# EasyEDA schematic SCH.json
TITLE: Sheet_1; REV: 1.0; Date: 2023-08-11; Sheet: 1/1; Drawn By: bqdrsrxq; Company: Your Company
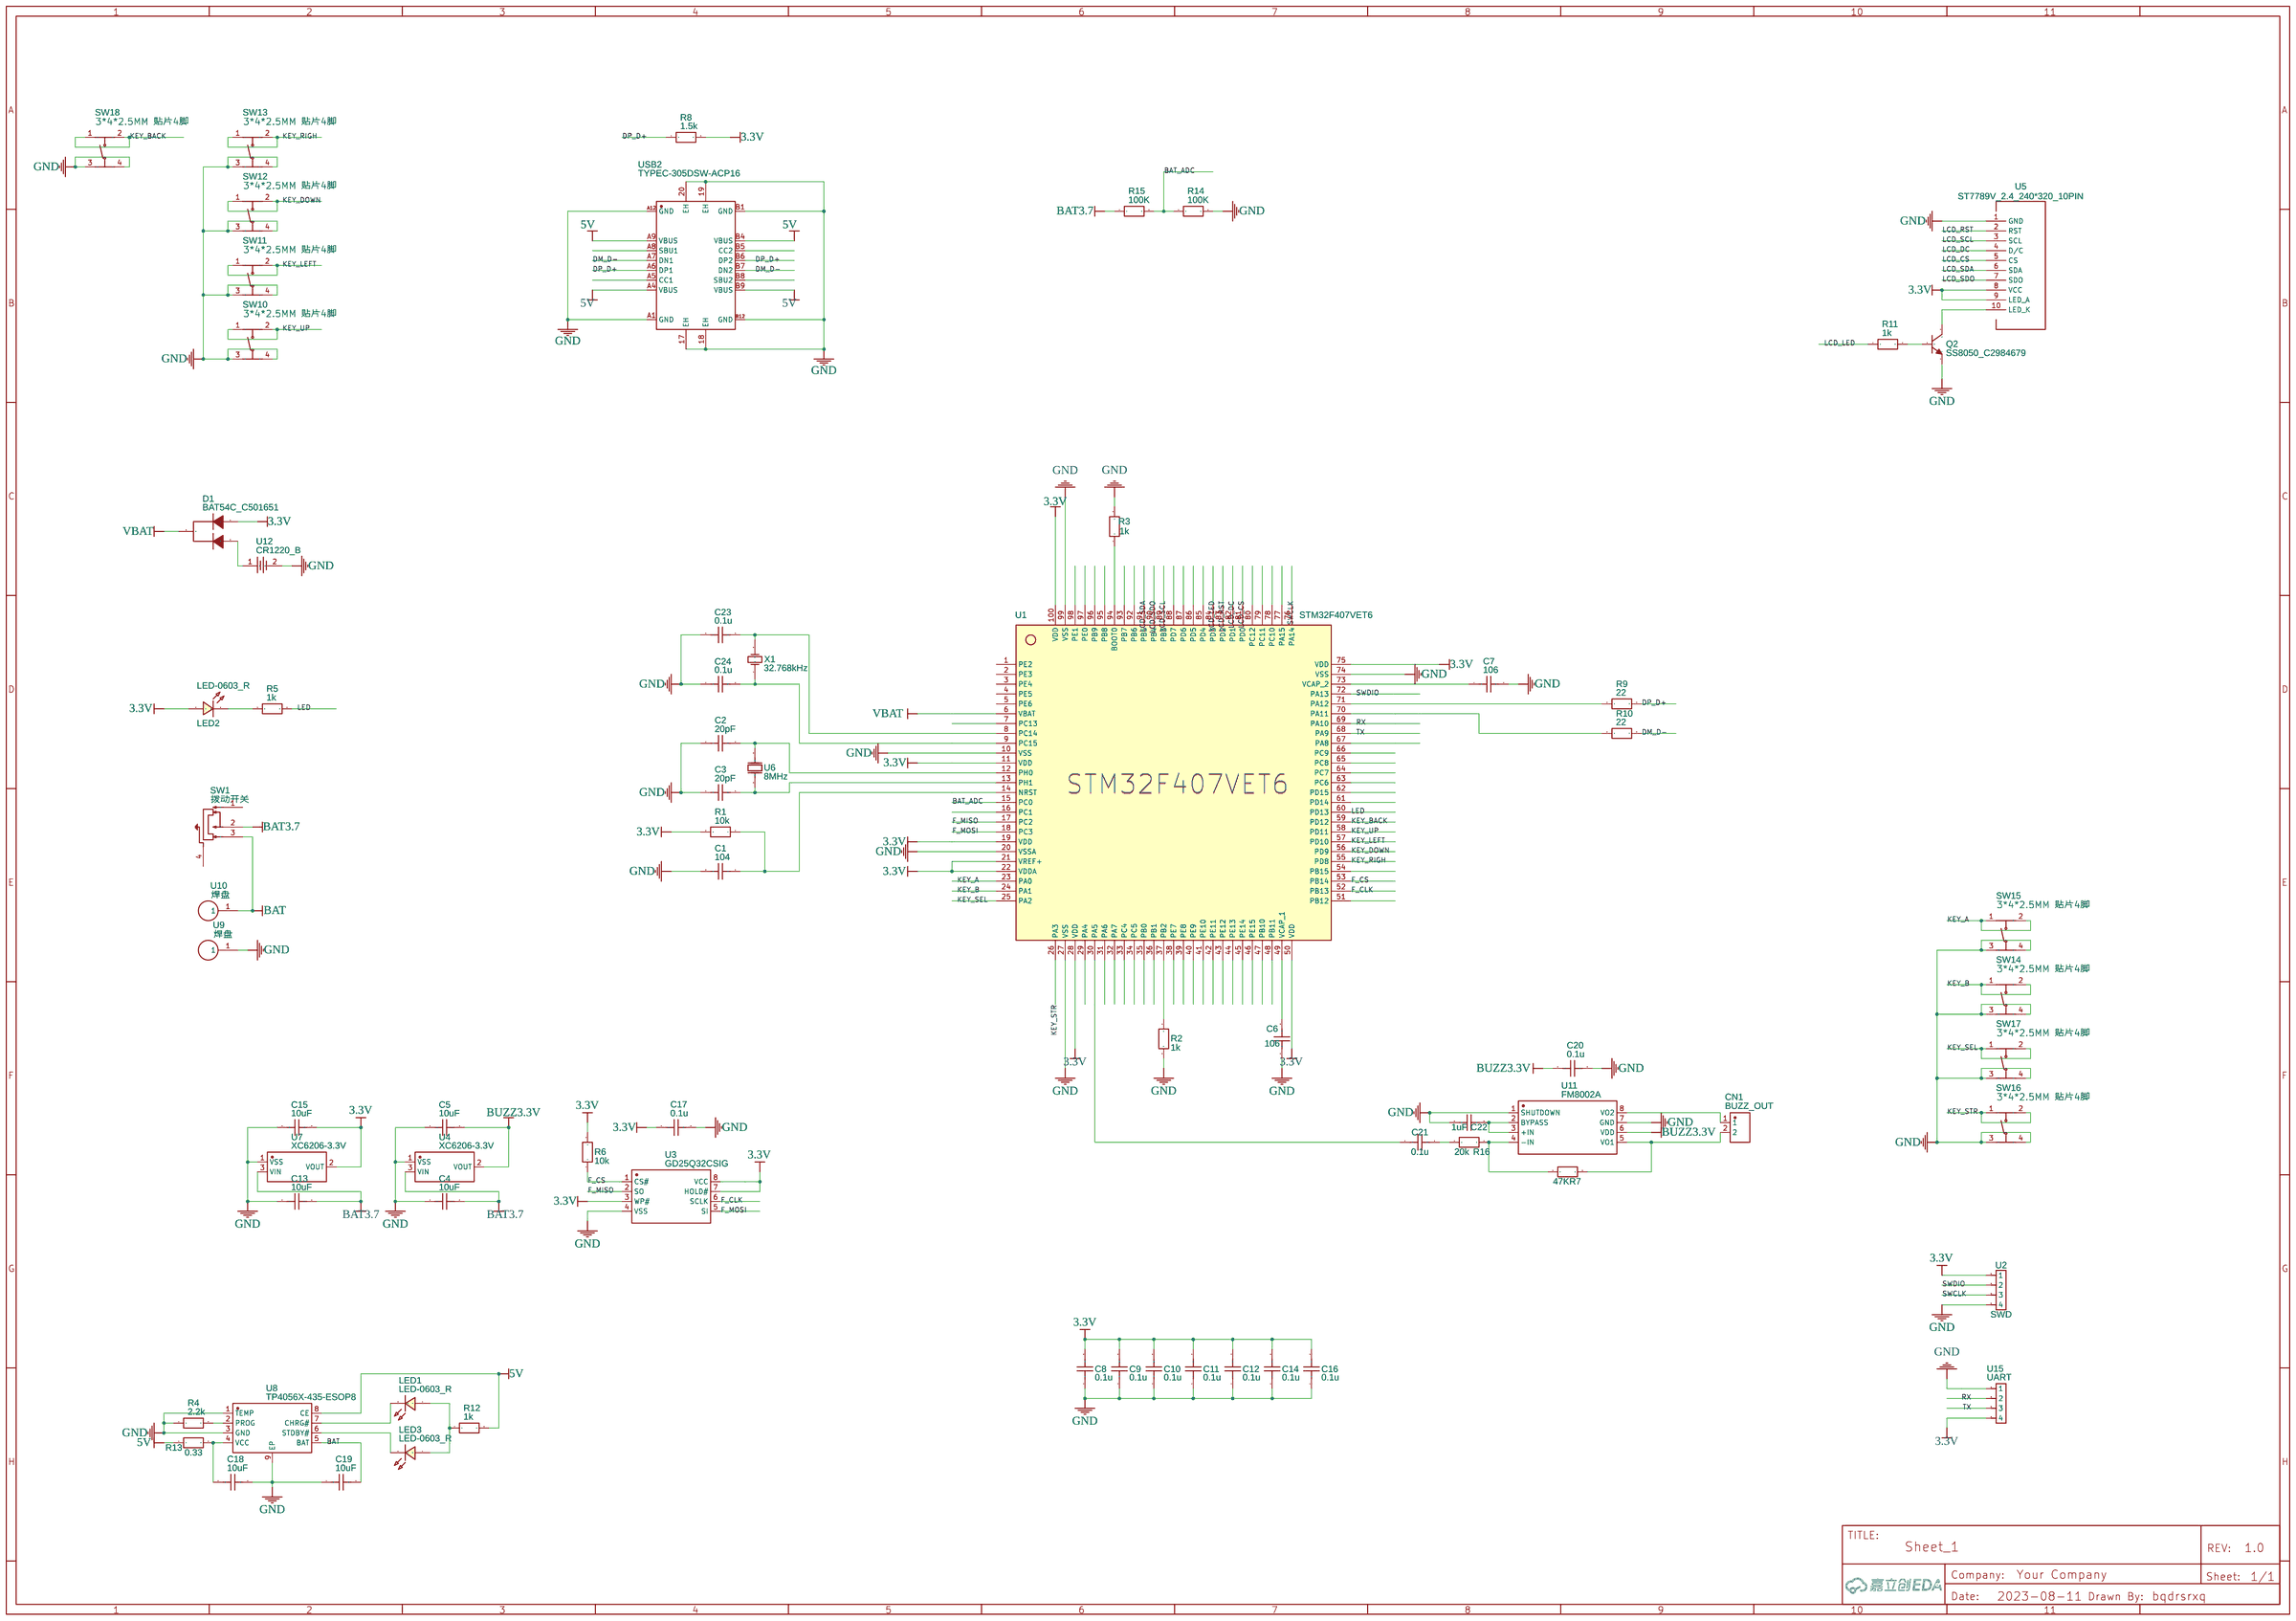
[diagram p0: schematic sheet]

## Parts
C1  104  [C0603]
C2  20pF  [C0603]
C3  20pF  [C0603]
C4  10uF  [C0603]
C5  10uF  [C0603]
C6  106  [C0603]
C7  106  [C0603]
C8  0.1u  [C0603]
C9  0.1u  [C0603]
C10  0.1u  [C0603]
C11  0.1u  [C0603]
C12  0.1u  [C0603]
C13  10uF  [C0603]
C14  0.1u  [C0603]
C15  10uF  [C0603]
C16  0.1u  [C0603]
C17  0.1u  [C0603]
C18  10uF  [C0603]
C19  10uF  [C0603]
C20  0.1u  [C0603]
C21  0.1u  [C0603]
C22  1uF  [C0603]
C23  0.1u  [C0603]
C24  0.1u  [C0603]
CN1  BUZZ_OUT  [CONN-TH_2P-P2.54-V]
D1  BAT54C_C501651  [SOT-23-3_L2.9-W1.3-P1.90-LS2.4-BR]
LED1  LED-0603_R  [LED0603_RED]
LED2  LED-0603_R  [LED0603_RED]
LED3  LED-0603_R  [LED0603_RED]
Q2  SS8050_C2984679  [SOT-23-3_L2.9-W1.3-P1.90-LS2.4-BR]
R1  10k  [R0603]
R2  1k  [R0603]
R3  1k  [R0603]
R4  2.2k  [R0603]
R5  1k  [R0603]
R6  10k  [R0603]
R7  47K  [R0603]
R8  1.5k  [R0603]
R9  22  [R0603]
R10  22  [R0603]
R11  1k  [R0603]
R12  1k  [R0603]
R13  0.33  [R0603]
R14  100K  [R0603]
R15  100K  [R0603]
R16  20k  [R0603]
SW1  拨动开关  [拨动开关_三脚两档4固定_贴片_侧拨_MSK12C01]
SW10  3*4*2.5MM 贴片4脚  [SW-SMD_4P-L4.2-W3.3-P2.15-LS5.1]
SW11  3*4*2.5MM 贴片4脚  [SW-SMD_4P-L4.2-W3.3-P2.15-LS5.1]
SW12  3*4*2.5MM 贴片4脚  [SW-SMD_4P-L4.2-W3.3-P2.15-LS5.1]
SW13  3*4*2.5MM 贴片4脚  [SW-SMD_4P-L4.2-W3.3-P2.15-LS5.1]
SW14  3*4*2.5MM 贴片4脚  [SW-SMD_4P-L4.2-W3.3-P2.15-LS5.1]
SW15  3*4*2.5MM 贴片4脚  [SW-SMD_4P-L4.2-W3.3-P2.15-LS5.1]
SW16  3*4*2.5MM 贴片4脚  [SW-SMD_4P-L4.2-W3.3-P2.15-LS5.1]
SW17  3*4*2.5MM 贴片4脚  [SW-SMD_4P-L4.2-W3.3-P2.15-LS5.1]
SW18  3*4*2.5MM 贴片4脚  [SW-SMD_4P-L4.2-W3.3-P2.15-LS5.1]
U1  STM32F407VET6  [STM32F407VET6]
U2  SWD  [CON4]
U3  GD25Q32CSIG  [SOP-8_L5.3-W5.3-P1.27-LS8.0-BL]
U4  XC6206-3.3V  [SSOT-3_L2.9-W1.6-P0.95-LS2.8-BR]
U5  ST7789V_2.4_240*320_10PIN  [ST7789V_2.4_240*320_10PIN]
U6  8MHz  [HC-49SMD_L11.1-W4.8]
U7  XC6206-3.3V  [SSOT-3_L2.9-W1.6-P0.95-LS2.8-BR]
U8  TP4056X-435-ESOP8  [ESOP-8_L4.9-W3.9-P1.27-LS6.0-BL-EP]
U9  焊盘  [焊盘]
U10  焊盘  [焊盘]
U11  FM8002A  [SOP-8_L4.9-W3.9-P1.27-LS6.0-BL]
U12  CR1220_B  [BAT-SMD_CR1220-2ZX]
U15  UART  [CON4]
USB2  TYPEC-305DSW-ACP16  [USB-C-SMD_TYPEC-305DSW-ACP16]
X1  32.768kHz  [OSC-TH_BD2.0-P0.70-D0.3]

## Library data of the parts
C1-C24 = C_0603_US: Contributor: LCEDA_Lib
CN1 = CON2-2.54*2P: Contributor: LCSC; Supplier: LCSC; Supplier Part: C9900003238; Manufacturer: null; JLCPCB Part Class: Extended Part
D1 = BAT54C_C501651: Contributor: LCSC; Supplier: LCSC; Supplier Part: C501651; Manufacturer: JF(吉福); JLCPCB Part Class: Extended Part
LED1-LED3 = LED-0603_R: Manufacturer: EVERLIGHT(台湾亿光); Manufacturer Part: 19-217/R6C-AL1M2VY/3T; Supplier Part: C72044; Supplier: LCSC; Contributor: LCEDA_01
Q2 = SS8050_C2984679: Contributor: LCSC; Supplier: LCSC; Supplier Part: C2984679; Manufacturer: 集晶电子; JLCPCB Part Class: Extended Part
R1-R16 = R_0603_EU: Contributor: LCEDA_Lib
SW1 = 拨动开关_三脚两档4固定_贴片_侧拨_MSK12C01: Supplier: LCSC; Supplier Part: C5149816; Manufacturer: hanxia(韩下); Manufacturer Part: HX MSK12C02-BB; link: https://atta.szlcsc.com/upload/public/pdf/source/20220909/B2E5E0B6B2E2D3025E4AA606FB85AB23.pdf; Contributor: crazydemo
SW10-SW18 = 3*4*2.5MM 贴片4脚: Contributor: lcsc; Supplier: LCSC; Supplier Part: C9900020788; Manufacturer: null; JLCPCB Part Class: Extended Part
U1 = STM32F407VET6: Manufacturer: ST; Supplier: LCSC; Contributor: 17684750421
U2 U15 = CON4: Contributor: mumupei
U3 = GD25Q32CSIG: Supplier: LCSC; Manufacturer: GigaDevice(兆易创新); Supplier Part: C79075; JLCPCB Part Class: Extended Part
U4 U7 = XC6206-3.3V: Supplier: LCSC; Supplier Part: C2891841; Manufacturer: YONGYUTAI(永裕泰); Contributor: LCSC; JLCPCB Part Class: Extended Part
U5 = ST7789V_2.4_240*320_10PIN: link: https://item.taobao.com/item.htm?_u=ko6gpjnbe45&id=579561491124; Contributor: eda198
U6 = ATS08ASM-1E: Contributor: LCSC; Supplier: LCSC; Supplier Part: C487700; Manufacturer: CTS(西迪斯); JLCPCB Part Class: Extended Part
U8 = TP4056X-435-ESOP8: Contributor: lcsc; Supplier: LCSC; Supplier Part: C3294513; Manufacturer: null; JLCPCB Part Class: Extended Part
U9 U10 = 焊盘: Contributor: sunyuan
U11 = FM8002A: Supplier: LCSC; Manufacturer: FM(富满); Supplier Part: C94625; JLCPCB Part Class: Extended Part
U12 = CR1220_B: Contributor: lcsc; Supplier: LCSC; Supplier Part: C9900012049; Manufacturer: null; JLCPCB Part Class: Extended Part
USB2 = TYPEC-305DSW-ACP16: Contributor: LCSC; Supplier: LCSC; Supplier Part: C2840388; Manufacturer: XUNPU(讯普); JLCPCB Part Class: Extended Part
X1 = Q2632768PWNAC: Contributor: LCSC; Supplier: LCSC; Supplier Part: C2681248; Manufacturer: JYJE(晶友嘉); JLCPCB Part Class: Extended Part

## Nets
3.3V: C8.2 C9.2 C10.2 C11.2 C12.2 C14.2 C15.2 C16.2 C17.1 D1.2(A2) LED2.1 R1.2 R6.2 R8.2 U1.11(VDD) U1.19(VDD) U1.21(VREF+) U1.22(VDDA) U1.28(VDD) U1.50(VDD) U1.75(VDD) U1.100(VDD) U2.P$1(1) U3.3(WP#) U3.7(HOLD#) U3.8(VCC) U5.8(VCC) U5.9(LED_A) U7.2(VOUT) U15.P$4(4)
5V: R12.2 R13.1 U8.8(CE) USB2.A4(VBUS) USB2.A9(VBUS) USB2.B4(VBUS) USB2.B9(VBUS)
GND: C1.2 C2.1 C3.1 C4.1 C5.1 C6.1 C7.2 C8.1 C9.1 C10.1 C11.1 C12.1 C13.1 C14.1 C15.1 C16.1 C17.2 C18.2 C19.1 C20.2 C22.1 C23.1 C24.1 Q2.2(E) R2.2 R3.2 R4.1 R14.2 SW10.3 SW10.4 SW11.3 SW11.4 SW12.3 SW12.4 SW13.3 SW13.4 SW14.3 SW14.4 SW15.3 SW15.4 SW16.3 SW16.4 SW17.3 SW17.4 SW18.3 SW18.4 U1.10(VSS) U1.20(VSSA) U1.27(VSS) U1.74(VSS) U1.99(VSS) U2.P$4(4) U3.4(VSS) U4.1(VSS) U5.1(GND) U7.1(VSS) U8.1(TEMP) U8.3(GND) U8.9(EP) U9.1 U11.1(SHUTDOWN) U11.7(GND) U12.2 U15.P$1(1) USB2.17(EH) USB2.18(EH) USB2.19(EH) USB2.20(EH) USB2.A1(GND) USB2.A12(GND) USB2.B1(GND) USB2.B12(GND)
VBAT: D1.3(K) U1.6(VBAT)
BAT: C19.2 SW1.3 U8.5(BAT) U10.1
BAT3.7: C4.2 C13.2 R15.1 SW1.2 U4.3(VIN) U7.3(VIN)
BAT_ADC: R14.1 R15.2 U1.15(PC0)
BUZZ3.3V: C5.2 C20.1 U4.2(VOUT) U11.6(VDD)
DM_D-: R10.2 USB2.A7(DN1) USB2.B7(DN2)
DP_D+: R8.1 R9.2 USB2.A6(DP1) USB2.B6(DP2)
F_CLK: U1.52(PB13) U3.6(SCLK)
F_CS: R6.1 U1.53(PB14) U3.1(CS#)
F_MISO: U1.17(PC2) U3.2(SO)
F_MOSI: U1.18(PC3) U3.5(SI)
KEY_A: SW15.1 SW15.2 U1.23(PA0)
KEY_B: SW14.1 SW14.2 U1.24(PA1)
KEY_BACK: SW18.1 SW18.2 U1.59(PD12)
KEY_DOWN: SW12.1 SW12.2 U1.56(PD9)
KEY_LEFT: SW11.1 SW11.2 U1.57(PD10)
KEY_RIGH: SW13.1 SW13.2 U1.55(PD8)
KEY_SEL: SW17.1 SW17.2 U1.25(PA2)
KEY_STR: SW16.1 SW16.2 U1.26(PA3)
KEY_UP: SW10.1 SW10.2 U1.58(PD11)
LCD_CS: U1.81(PD0) U5.5(CS)
LCD_DC: U1.82(PD1) U5.4(D/C)
LCD_LED: R11.1 U1.84(PD3)
LCD_RST: U1.83(PD2) U5.2(RST)
LCD_SCL: U1.89(PB3) U5.3(SCL)
LCD_SDA: U1.91(PB5) U5.6(SDA)
LCD_SDO: U1.90(PB4) U5.7(SDO)
LED: R5.2 U1.60(PD13)
RX: U1.69(PA10) U15.P$2(2)
SWCLK: U1.76(PA14) U2.P$3(3)
SWDIO: U1.72(PA13) U2.P$2(2)
TX: U1.68(PA9) U15.P$3(3)
Net-(C1-1): C1.1 R1.1 U1.14(NRST)
Net-(C2-2): C2.2 U1.12(PH0) U6.2(OSC2)
Net-(C3-2): C3.2 U1.13(PH1) U6.1(OSC1)
Net-(C6-2): C6.2 U1.49(VCAP_1)
Net-(C7-1): C7.1 U1.73(VCAP_2)
Net-(C18-1): C18.1 R13.2 U8.4(VCC)
Net-(C21-1): C21.1 U1.30(PA5)
Net-(C21-2): C21.2 R16.1
Net-(C22-2): C22.2 U11.2(BYPASS) U11.3(+IN)
Net-(C23-2): C23.2 U1.8(PC14) X1.2(OSC2)
Net-(C24-2): C24.2 U1.9(PC15) X1.1(OSC1)
Net-(CN1-1): CN1.1 U11.8(VO2)
Net-(CN1-2): CN1.2 R7.2 U11.5(VO1)
Net-(D1-1): D1.1(A1) U12.1
Net-(LED1-1): LED1.1 LED3.1 R12.1
Net-(LED1-2): LED1.2 U8.7(CHRG#)
Net-(LED2-2): LED2.2 R5.1
Net-(LED3-2): LED3.2 U8.6(STDBY#)
Net-(Q2-1): Q2.1(B) R11.2
Net-(Q2-3): Q2.3(C) U5.10(LED_K)
Net-(R2-1): R2.1 U1.37(PB2)
Net-(R3-1): R3.1 U1.94(BOOT0)
Net-(R4-2): R4.2 U8.2(PROG)
Net-(R7-1): R7.1 R16.2 U11.4(-IN)
Net-(R9-1): R9.1 U1.71(PA12)
Net-(R10-1): R10.1 U1.70(PA11)

Not connected (* = marked no-connect by the designer): SW1 1 4; U1 1(PE2) 2(PE3) 3(PE4) 4(PE5) 5(PE6) 7(PC13) 16(PC1) 29(PA4) 31(PA6) 32(PA7) 33(PC4) 34(PC5) 35(PB0) 36(PB1) 38(PE7) 39(PE8) 40(PE9) 41(PE10) 42(PE11) 43(PE12) 44(PE13) 45(PE14) 46(PE15) 47(PB10) 48(PB11) 51(PB12) 54(PB15) 61(PD14) 62(PD15) 63(PC6) 64(PC7) 65(PC8) 66(PC9) 67(PA8) 77(PA15) 78(PC10) 79(PC11) 80(PC12) 85(PD4) 86(PD5) 87(PD6) 88(PD7) 92(PB6) 93(PB7) 95(PB8) 96(PB9) 97(PE0) 98(PE1); USB2 A5(CC1) A8(SBU1) B5(CC2) B8(SBU2)

## Notes on the sheet
- STM32F407VET6
